# EAGLE design Adapter boardV1 (EAGLE 9.1.1)
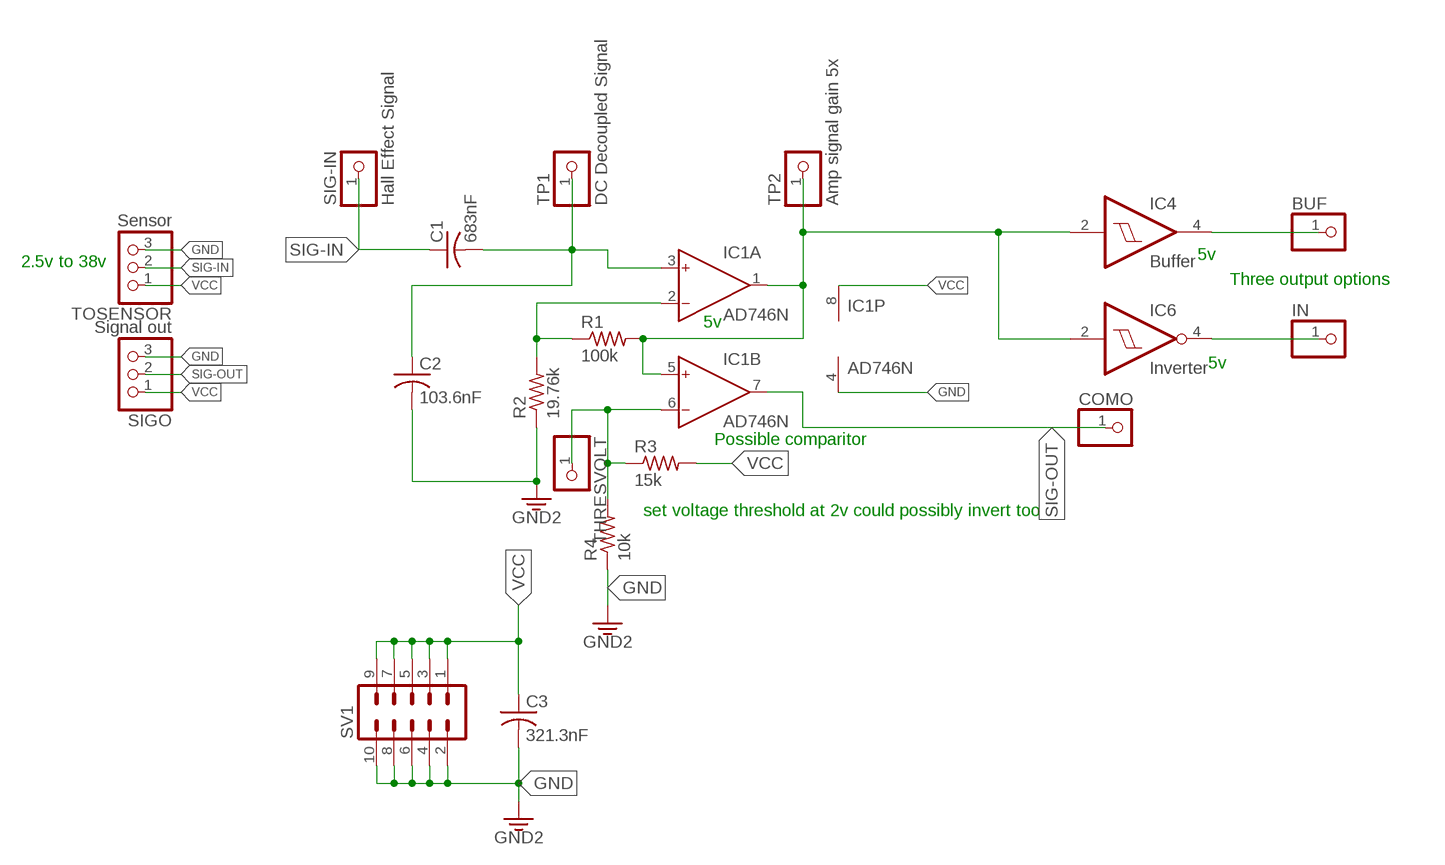
[diagram p0: schematic, sheet 1]

## Parts
BUF  PINHD-1X1  [1X01]
C1  683nF  C-USC0805  [C0805]
C2  103.6nF  C-USC0805  [C0805]
C3  321.3nF  C-USC0805  [C0805]
COMO  PINHD-1X1  [1X01]
IC1  AD746N  [DIL08]
IC4  Buffer  74LVC1G17DBV  [SOT23-5]
IC6  Inverter  74LVC1G14DBV  [SOT23-5]
IN  PINHD-1X1  [1X01]
R1  100k  R-US_FLIPFLOP7  [0805-THM-7]
R2  19.76k  R-US_FLIPFLOP7  [0805-THM-7]
R3  15k  R-US_FLIPFLOP7  [0805-THM-7]
R4  10k  R-US_FLIPFLOP7  [0805-THM-7]
SIG-IN  Hall Effect Signal  PINHD-1X1  [1X01]
SIGO  Signal out  PINHD-1X3  [1X03]
SV1  MA05-2  [MA05-2]
THRESVOLT  PINHD-1X1  [1X01]
TOSENSOR  Sensor  PINHD-1X3  [1X03]
TP1  DC Decoupled Signal  PINHD-1X1  [1X01]
TP2  Amp signal gain 5x  PINHD-1X1  [1X01]

## Nets
GND: C2.2 C3.2 IC1.4(P:V-) R2.1 R4.1 SIGO.3 SV1.2 SV1.4 SV1.6 SV1.8 SV1.10 TOSENSOR.3 ; supply symbol labelled GND2
N$1: C1.2 C2.1 IC1.3(A:IN+) TP1.1
N$2: IC1.6(B:IN-) R3.1 R4.2 THRESVOLT.1
N$3: BUF.1 IC4.4(O)
N$4: IC1.2(A:IN-) R1.1 R2.2
N$5: IC1.1(A:OUT) IC1.5(B:IN+) IC4.2(I) IC6.2(I) R1.2 TP2.1
N$6: IC6.4(O) IN.1
SIG-IN: C1.1 SIG-IN.1 TOSENSOR.2
SIG-OUT: COMO.1 IC1.7(B:OUT) SIGO.2
VCC: C3.1 IC1.8(P:V+) R3.2 SIGO.1 SV1.1 SV1.3 SV1.5 SV1.7 SV1.9 TOSENSOR.1

## Notes on the sheet
- 5v
- 2.5v to 38v
- Three output options
- 5v
- 5v
- Possible comparitor
- set voltage threshold at 2v could possibly invert too

## Power pins joined to a net without a drawn wire
GND: IC4.3(GND) IC6.3(GND)
VCC: IC4.5(VCC) IC6.5(VCC)

## Library data of the parts
BUF COMO IN SIG-IN THRESVOLT TP1 TP2 = pinhead:PINHD-1X1: PIN HEADER
C1-C3 = adafruit:C-US: CAPACITOR, American symbol
IC1 = analog-devices:AD746: Dual Precision, 500 ns Settling, BiFET Op Amp Source: http://www.analog.com/static/imported-files/data_sheets/AD746.pdf; MF: ALTERA CORPORATION; MPN: AD746JNZ; OC_FARNELL: 1438363; OC_NEWARK: 59K4844
IC4 = 74xx-little-us:74*1G17: Single Schmitt-Trigger Buffer
IC6 = 74xx-little-us:74*1G14: Single Schmitt-Trigger Inverter Gate
R1-R4 = adafruit:R-US_: RESISTOR, American symbol
SIGO TOSENSOR = pinhead:PINHD-1X3: PIN HEADER
SV1 = con-lstb:MA05-2: PIN HEADER; OC_FARNELL: unknown; OC_NEWARK: unknown

## Board
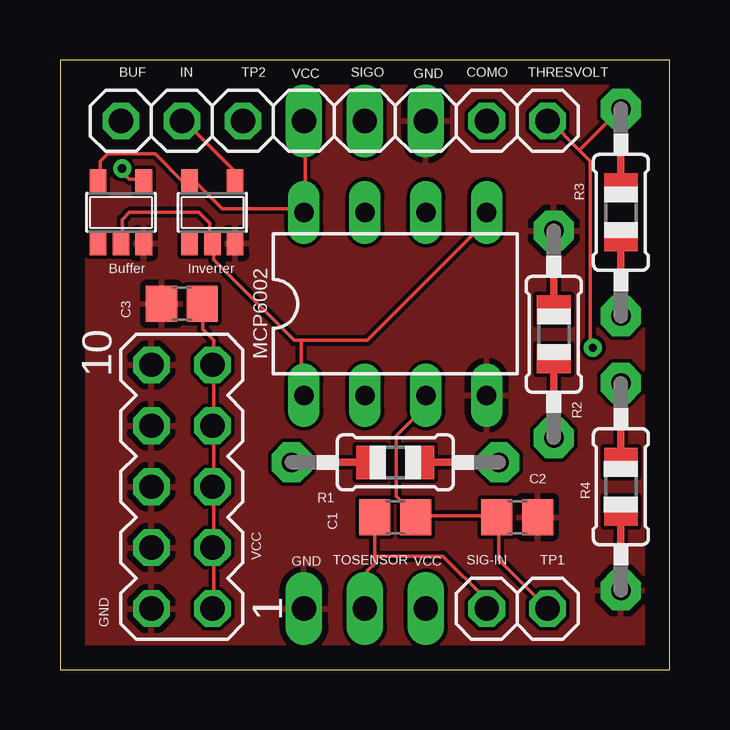
[diagram p1: board, top side]
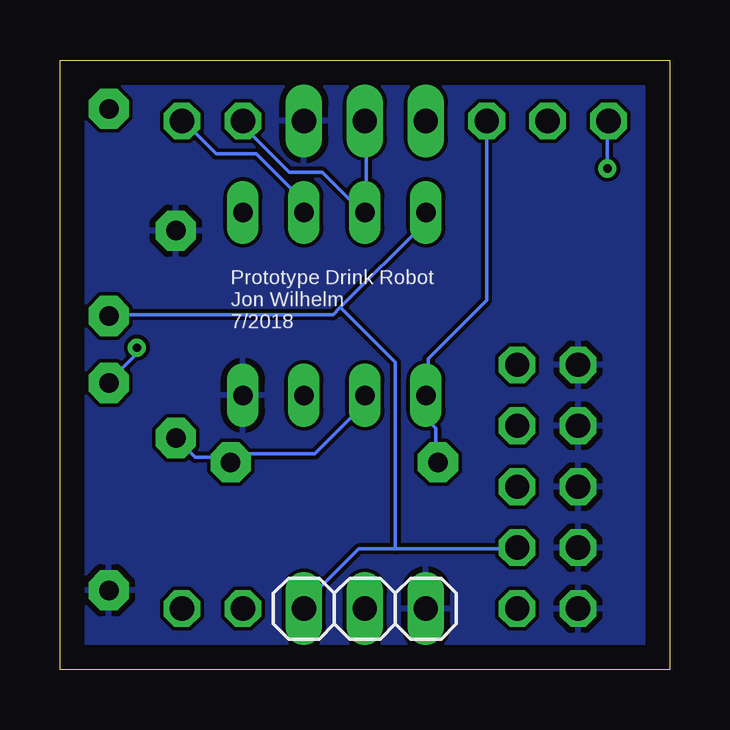
[diagram p2: board, bottom side, seen from below]

Size 25.4 x 25.4 mm. Coordinates in mm from the lower left corner, seen from the top.
Outline: 0,0 25.4,0 25.4,25.4 0,25.4 0,0
Copper layers (1*16): Top 0.035mm / dielectric 1.5mm / Bottom 0.035mm
Design rules "default": minimum track width 6mil, minimum drill 0.35mm, track to track 6mil, track to pad 6mil, pad to pad 6mil, via to via 6mil, smd to smd 6mil, copper to edge 40mil, drill to drill 6mil, minimum pad ring 10mil, minimum via ring 8mil, stop-mask expansion 4mil, vias tented up to drill 0mil, thermal gap 10mil

### Footprints (pad centres in the part's own frame; a part is rotated, then mirrored left to right if it is on the bottom)
1X01 = drill 1.016 octagon: 1 0,0
C0805 = smd 1.3 x 1.5: 1 -0.85,0; 2 0.85,0
DIL08 = drill 0.813 long: 1 -3.81,-3.81; 2 -1.27,-3.81; 3 1.27,-3.81; 4 3.81,-3.81; 5 3.81,3.81; 6 1.27,3.81; 7 -1.27,3.81; 8 -3.81,3.81
SOT23-5 = smd 0.69 x 0.99: 1 -0.95,-1.29; 2 0,-1.29; 3 0.95,-1.29; 4 0.95,1.3; 5 -0.95,1.3
0805-THM-7 = drill 0.813 pad 1.676 octagon: 1 -4.318,0; 2 4.318,0
1X03 = drill 1.016 long: 1 -2.54,0; 2 0,0; 3 2.54,0
MA05-2 = drill 1.016 octagon: 1 -5.08,-1.27; 2 -5.08,1.27; 3 -2.54,-1.27; 4 -2.54,1.27; 5 0,-1.27; 6 0,1.27; 7 2.54,-1.27; 8 2.54,1.27; 9 5.08,-1.27; 10 5.08,1.27

### Placement (x,y rotation side)
BUF  2.54,22.86 0 top
C1  13.97,6.35 0 top
C2  19.05,6.35 0 top
C3  5.08,15.24 180 top
COMO  17.78,22.86 0 top
IC1  13.97,15.24 0 top
IC4  2.54,19.05 0 top
IC6  6.35,19.05 0 top
IN  5.08,22.86 0 top
R1  13.97,8.64 180 top
R2  20.57,13.97 270 top
R3  23.37,19.05 270 top
R4  23.37,7.62 90 top
SIG-IN  17.78,2.54 0 top
SIGO  12.7,22.86 0 top
SV1  5.08,7.62 90 top
THRESVOLT  20.32,22.86 0 top
TOSENSOR  12.7,2.54 0 bottom
TP1  20.32,2.54 0 top
TP2  7.62,22.86 0 top

### Tracks (layer width: path | path; a pad name or v marks a point on that pad's centre or on a via)
GND
  pour Top: 0,0 25.4,0 25.4,25.4 0,25.4
  pour Bottom: 0,0 25.4,0 25.4,25.4 0,25.4
N$1
  Top 0.152: TP1.1 20.27,2.59 18.29,4.57 18.29,6.25 C2.1 18.14,6.4 14.94,6.4 C1.2 14.64,6.59 14.02,7.21 14.02,9.75 15.24,10.97 IC1.3
N$2  (via drill 0.35)
  Top 0.152: 21.64,21.64 20.42,22.86 THRESVOLT.1 | 21.64,21.64 22.1,21.18 22.1,13.51 v22.2,13.41 | 21.64,21.64 23.32,23.32 R3.1
  Bottom 0.152: IC1.6 15.24,19.51 17.22,21.49 18.9,21.49 20.27,22.86 THRESVOLT.1 | v22.2,13.41 22.2,13.16 23.32,12.04 R4.2
N$3  (via drill 0.35)
  Top 0.152: v2.59,20.88 2.59,20.73 2.9,20.42 3.35,20.42 IC4.4
  Bottom 0.152: v2.59,20.88 2.59,22.86 BUF.1
N$4
  Bottom 0.152: IC1.2 12.8,11.43 12.8,10.97 14.78,8.99 18.29,8.99 R1.1 18.49,8.84 19.76,8.84 R2.2
N$5
  Top 0.152: IC4.2 2.59,17.83 2.59,18.75 2.9,19.05 5.79,19.05 6.25,18.59 6.25,17.83 IC6.2 6.35,17.61 6.4,17.52 6.4,17.07 9.75,13.72 10.06,13.72 | 10.06,13.72 10.06,11.43 IC1.1 | 10.06,13.72 12.8,13.72 17.68,18.59 17.68,19.05 IC1.5
  Bottom 0.152: TP2.1 7.62,15.39 10.06,12.95 10.06,11.43 | 10.06,11.43 IC1.1 10.06,11.43 | 10.06,11.43 10.06,10.36 9.75,10.06 9.75,8.74 R1.2
N$6
  Top 0.152: IC6.4 7.32,20.42 7.32,20.73 5.18,22.86 IN.1
SIG-IN
  Top 0.152: 13.11,4.72 13.11,4.42 12.8,4.12 12.8,2.59 TOSENSOR.2 | 13.11,4.72 13.11,6.25 C1.1 | 13.11,4.72 15.95,4.72 17.73,2.95 17.73,2.59 SIG-IN.1
SIG-OUT
  Bottom 0.152: SIGO.2 12.65,22.86 12.65,21.79 12.65,19.96 12.65,19.05 IC1.7 12.8,19.05 14.48,20.73 15.85,20.73 17.78,22.66 COMO.1
VCC
  Top 0.152: C3.1 5.94,15.24 5.94,14.17 6.4,13.72 6.4,12.8 SV1.9 6.4,12.65 6.4,10.21 SV1.7 6.4,10.06 6.4,7.62 | 6.4,7.62 SV1.5 6.4,7.62 | SV1.1 6.4,2.59 6.4,5.03 SV1.3 6.4,5.18 6.4,7.62 | IC4.5 1.68,20.42 1.68,21.18 1.98,21.49 3.96,21.49 5.18,20.27 5.33,20.27 IC6.5 5.49,20.27 5.69,20.27 6.76,19.2 9.91,19.2 | 9.91,19.2 10.06,19.05 IC1.8 9.91,19.2 | 9.91,19.2 9.91,19.66 10.21,19.96 10.21,21.79 10.21,22.86 SIGO.1
  Bottom 0.152: 11.43,5.03 6.4,5.03 SV1.3 | 11.43,5.03 12.95,5.03 15.24,2.74 TOSENSOR.1 | 13.72,15.09 10.21,18.59 10.21,19.05 IC1.8 | 13.72,15.09 14.02,14.78 23.32,14.78 R3.2 | 11.43,5.03 11.43,12.8 13.72,15.09

### Text on the board
tPlace: VCC | GND | VCC | GND | VCC | GND
bPlace: Prototype Drink Robot / Jon Wilhelm / 7/2018
tNames: MCP6002